# Altium schematic sheet 5VSupply.SchDoc
size A
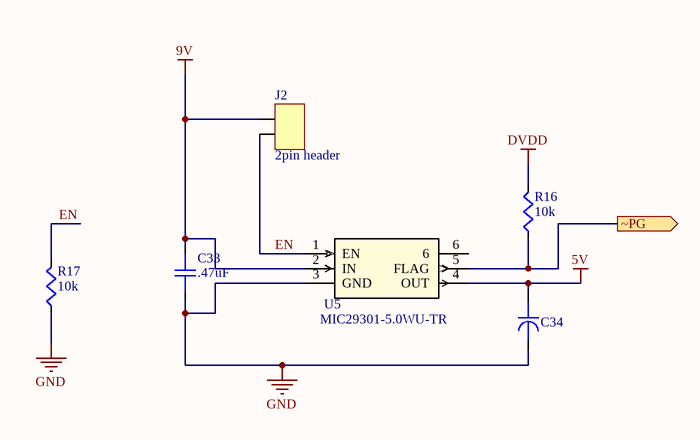
[diagram p0: 5VSupply.SchDoc]

## Parts
C33  .47uF  [C0805]
C34  22UF TANT  [CAP_293D_D_VIS]  (value not drawn)
J2  2pin header  [HEADERPINS_2x1]
R16  10k  [R0603]
R17  10k  [R0603]
U5  MIC29301-5.0WU-TR  [TO-263-5_MCH]

## Ports
~PG (out)

## Nets
5V: C34.2 U5.4(OUT)
9V: C33.2 J2.2 U5.2(IN)
DVDD: R16.2
GND: C33.1 C34.1 R17.1 U5.3(GND)
EN: J2.1 R17.2 U5.1(EN)
~PG: R16.1 U5.5(FLAG) ; port ~PG

Not connected (* = marked no-connect by the designer): U5 6

## Library data of the parts
C33 = VJ0805Y474JXJTW1BC: Multilayer Ceramic Capacitors MLCC - SMD/SMT 0805 0.47uF 16volts X7R 5%; Manufacturer 1: Vishay Vitramon; Dielectric Material: Tantalum; Voltage Rating (DC): 16V; Capacitance: 470nF; Supplier 1: Digi-Key; Supplier Part Number 1: 720-1774-1-ND; Manufacturer Part Number 1: VJ0805Y474JXJTW1BC; Stock 1: 1897; Pricing 1: 1=0.39000, 10=0.27000, 100=0.16180, 500=0.12132, 1000=0.10245 (USD); RoHS: Yes; Mount: Surface Mount; Case/Package: 0805; Case Code (Imperial): 0805; Case Code (Metric): 2012; Min Operating Temperature: -55°C; Max Operating Temperature: 125°C; Tolerance: 5%; Packaging: Tape and Reel; Package Quantity: 3000; Dielectric: X7R; Termination: SMD/SMT; Length: 2mm; Height: 1.45mm; Width: 1.25mm; Depth: 1.25mm; Lead Free: Lead Free; ComponentLink1URL: https://datasheet.ciiva.com/11490/vjw1bcbascomseries-11490678.pdf?src-supplier=Avnet; ComponentLink1Description: https://datasheet.ciiva.com/11490/vjw1bcbascomseries-11490678.pdf?src-supplier=Avnet; ComponentLink2URL: https://datasheet.ciiva.com/5427/vjw1bcbascomseries-223529-5427159.pdf?src-supplier=Mouser; ComponentLink2Description: https://datasheet.ciiva.com/5427/vjw1bcbascomseries-223529-5427159.pdf?src-supplier=Mouser
C34 = 293D226X9035D2TE3: CAP TANT 22UF 10% 35V 2917; Manufacturer 1: Vishay Sprague; Dielectric Material: Tantalum; ESR (Equivalent Series Resistance): 600mR; Polarity: Polar; Ripple Current: 500mA; Dissipation Factor: 6%; Voltage Rating (DC): 300kV; Leakage Current: 7.7uA; Supplier 1: Digi-Key; Supplier Part Number 1: 718-1071-1-ND; Manufacturer Part Number 1: 293D226X9035D2TE3; RoHS: Yes; Category: Tantalum Capacitors; Stock 1: 31; Pricing 1: 1=1.00000, 10=0.78800, 50=0.68260, 100=0.59060 (USD); Mount: Surface Mount,PCB; Case/Package: 2917; Case Code (Imperial): 2917; Case Code (Metric): 7343; Weight: 0.023634oz; Min Operating Temperature: -55°C; Max Operating Temperature: 125°C; Capacitance: 22uF; Tolerance: 10%; Voltage: 35V; Voltage Rating: 35V; Packaging: Tape and Reel; Package Quantity: 1; Termination: SMD/SMT; Features: General Purpose; Length: 7.3mm; Width: 2.8mm; Height: 2.8mm; Depth: 4.3mm; Height - Seated (Max): 0.122inch; Radiation Hardening: No; Lead Free: Lead Free; REACH SVHC: Unknown; ComponentLink1URL: https://datasheet.ciiva.com/11793/0900766b80d97b37-11793792.pdf?src-supplier=RSComponents; ComponentLink1Description: https://datasheet.ciiva.com/11793/0900766b80d97b37-11793792.pdf?src-supplier=RSComponents; ComponentLink2URL: https://datasheet.ciiva.com/3003/293d-3003938.pdf?src-supplier=Avnet; ComponentLink2Description: https://datasheet.ciiva.com/3003/293d-3003938.pdf?src-supplier=Avnet; ComponentLink3URL: https://datasheet.ciiva.com/16357/293d-16357928.pdf?src-supplier=Future+Electronics; ComponentLink3Description: https://datasheet.ciiva.com/16357/293d-16357928.pdf?src-supplier=Future+Electronics; ComponentLink4URL: https://datasheet.ciiva.com/22695/438417-22695144.pdf?src-supplier=Element14; ComponentLink4Description: https://datasheet.ciiva.com/22695/438417-22695144.pdf?src-supplier=Element14; ComponentLink5URL: https://datasheet.ciiva.com/260/293d-260029.pdf?src-supplier=Digi-Key; ComponentLink5Description: https://datasheet.ciiva.com/260/293d-260029.pdf?src-supplier=Digi-Key; ComponentLink6URL: https://datasheet.ciiva.com/260/293d-260031.pdf?src-supplier=Digi-Key; ComponentLink6Description: https://datasheet.ciiva.com/260/293d-260031.pdf?src-supplier=Digi-Key; ComponentLink7URL: https://datasheet.ciiva.com/1463/438417-1463353.pdf?src-supplier=Element14; ComponentLink7Description: https://datasheet.ciiva.com/1463/438417-1463353.pdf?src-supplier=Element14; ComponentLink8URL: https://datasheet.ciiva.com/260/293d-260030.pdf?src-supplier=Digi-Key; ComponentLink8Description: https://datasheet.ciiva.com/260/293d-260030.pdf?src-supplier=Digi-Key
J2 = J2
R16 R17 = RC0603JR-0710KL: RES SMD 10K OHM 5% 1/10W 0603
U5 = MIC29301-5.0WU-TR: LDO Regulator Pos 5V 3A Automotive 6-Pin(5+Tab) TO-263 T/R; Manufacturer 1: Microchip; Supplier 1: Digi-Key; Supplier Part Number 1: MIC29301-5.0WU-CT-ND; Manufacturer Part Number 1: MIC29301-5.0WU-TR; RoHS: Yes; Category: Voltage Regulators - Linear; Stock 1: 1017; Pricing 1: 1=4.14000, 25=3.45000, 100=3.14000 (USD); ComponentLink1URL: https://datasheet.ciiva.com/16389/mic29150-16389820.pdf?src-supplier=Future+Electronics; ComponentLink1Description: https://datasheet.ciiva.com/16389/mic29150-16389820.pdf?src-supplier=Future+Electronics; ComponentLink2URL: https://datasheet.ciiva.com/2064/mic29150-2064680.pdf?src-supplier=Digi-Key; ComponentLink2Description: https://datasheet.ciiva.com/2064/mic29150-2064680.pdf?src-supplier=Digi-Key